# EAGLE design eye_junction (EAGLE 7.3.0)
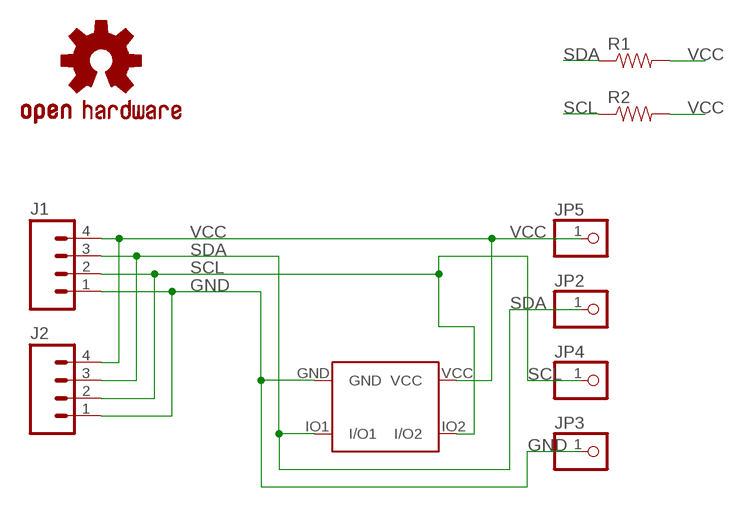
[diagram p0: schematic, sheet 1]

## Parts
J1  M04JST-PTH-VERT  [JST-4-PTH-VERT]
J2  M04JST-PTH-VERT  [JST-4-PTH-VERT]
JP2  PINHD-1X1CB  [1X01-CLEANBIG]
JP3  PINHD-1X1CB  [1X01-CLEANBIG]
JP4  PINHD-1X1CB  [1X01-CLEANBIG]
JP5  PINHD-1X1CB  [1X01-CLEANBIG]
LOGO1  OSHW-LOGOS  [OSHW-LOGO-S]
R1  RESISTORAXIAL-0.3  [AXIAL-0.3]
R2  RESISTORAXIAL-0.3  [AXIAL-0.3]
U$2  TVS_ARRAY_CD143A  [SOT-143]

## Nets
GND: J1.1 J2.1 JP3.1 U$2.GND
SCL: J1.2 J2.2 JP4.1 R2.P$1 U$2.IO2(I/O2)
SDA: J1.3 J2.3 JP2.1 R1.P$1 U$2.IO1(I/O1)
VCC: J1.4 J2.4 JP5.1 R1.P$2 R2.P$2 U$2.VCC

## Library data of the parts
J1 J2 = SparkFun-Connectors:M04: Header 4 Standard 4-pin 0.1" header. Use with straight break away headers (SKU : PRT-00116), right angle break away headers (PRT-00553), swiss pins (PRT-00743), machine pins (PRT-00117), and female headers (PRT-00115). Molex polarized connector foot print use with SKU : PRT-08231 with associated crimp pins and housings. 1MM SMD Version SKU: PRT-10208; PROD_ID: CONN-13251
JP2-JP5 = adafruit:PINHD-1X1: Pin header 1x1 for 0.1" spacing With round pins
LOGO1 = SparkFun-Aesthetics:OSHW-LOGO: Open Source Hardware Logo This logo indicates the piece of hardware it is found on incorporates a OSHW license and/or adheres to the definition of open source hardware found here: http://freedomdefined.org/OSHW
R1 R2 = SparkFun-Passives:RESISTOR: Resistor Basic schematic elements and footprints for 0603, 1206, and PTH resistors.
U$2 = skeleton:TVS_ARRAY_CD143A

## Board
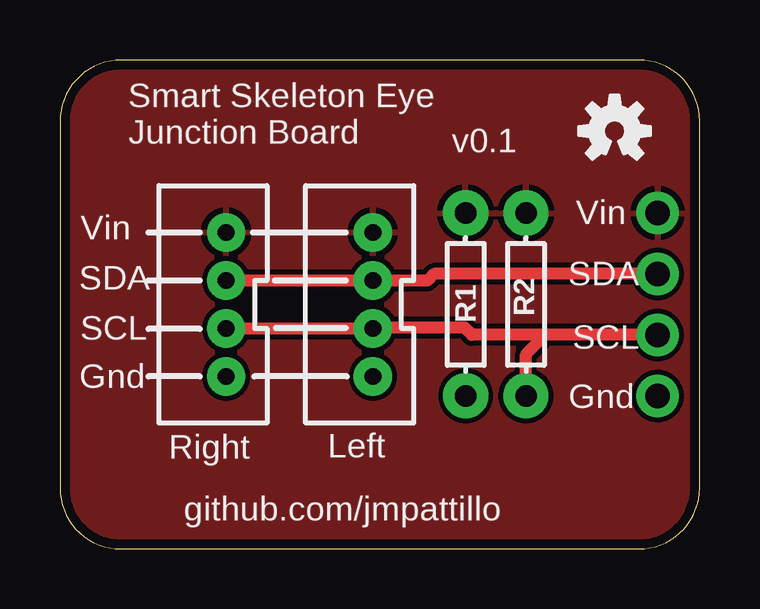
[diagram p1: board, top side]
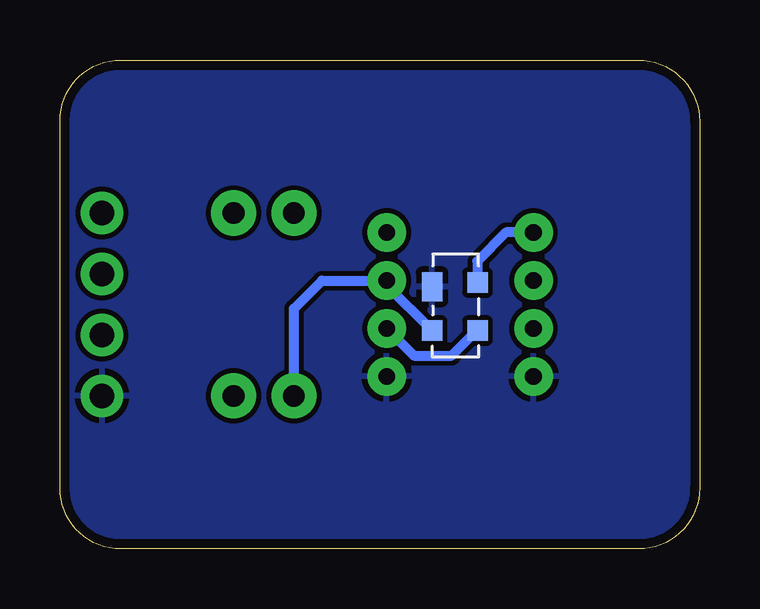
[diagram p2: board, bottom side, seen from below]

Size 26.67 x 20.37 mm. Coordinates in mm from the lower left corner, seen from the top.
Outline: 24.13,0 arc90 26.67,2.54 26.67,17.83 arc90 24.13,20.37 2.56,20.37 arc90 0,17.81 0,2.54 arc90 2.54,0 24.13,0
Copper layers (1*16): Top 0.0356mm / dielectric 1.5011mm / Bottom 0.0356mm
Design rules "LaenPCBOrder *": minimum track width 6mil, minimum drill 13mil, track to track 8mil, track to pad 7mil, pad to pad 8mil, via to via 8mil, smd to smd 8mil, copper to edge 15mil, drill to drill 6mil, minimum pad ring 7mil, minimum via ring 7mil, stop-mask expansion 3mil, vias tented up to drill 25mil, thermal gap 10mil

### Footprints (pad centres in the part's own frame; a part is rotated, then mirrored left to right if it is on the bottom)
JST-4-PTH-VERT = drill 0.7 pad 1.6: 1 -3,-0.55; 2 -1,-0.55; 3 1,-0.55; 4 3,-0.55
1X01-CLEANBIG = drill 1.016 pad 1.778: 1 0,0
AXIAL-0.3 = drill 0.9 pad 1.88: P$1 -3.81,0; P$2 3.81,0
SOT-143 = smd 1.2 x 0.85: GND -0.75,-0.95 | smd 0.85 x 0.85: IO1 1.075,-0.95; IO2 1.075,0.95; VCC -0.925,0.95

### Placement (x,y rotation side)
J1  6.38,10.19 90 top
J2  12.5,10.19 90 top
JP2  24.92,11.46 0 top
JP3  24.92,6.38 0 top
JP4  24.92,8.92 0 top
JP5  24.92,14 0 top
LOGO1  23.13,17.41 0 top
R1  16.92,10.19 90 top
R2  19.43,10.19 90 top
U$2  10.21,10.18 270 bottom

### Tracks (layer width: path | path; a pad name or v marks a point on that pad's centre or on a via)
GND
  pour Bottom: -0.12,20.83 27.05,21.4 26.92,-0.13 -0.25,-0.01
SCL
  Top 0.508: J1.2 J2.2 13.08,9.22 16.87,9.22 17.17,8.92 20.24,8.92 | JP4.1 20.24,8.92 | R2.P$1 19.43,8.1 20.24,8.92
  Bottom 0.406: J2.2 11.91,8.05 10.34,8.05 9.29,9.1 U$2.IO2
SDA
  Top 0.508: J1.3 J2.3 13.06,11.18 15.32,11.18 15.6,11.46 JP2.1
  Bottom 0.406: U$2.IO1 13.05,10.99 J2.3 13.06,11.18 15.75,11.18 16.92,10.01 R1.P$1
VCC
  Bottom 0.406: J1.4 8.07,13.19 9.27,11.99 9.27,11.12 U$2.VCC
  pour Top: -0.96,20.68 27.44,20.64 27.24,-0.59 15.87,-0.64 15.82,-0.66 13.39,-0.66 13.28,-0.63 -0.7,-0.63

### Text on the board
tNames: Smart Skeleton Eye / Junction Board | v0.1 | Vin | Vin | SDA | SDA | SCL | SCL | Gnd | Gnd | Right | Left | github.com/jmpattillo